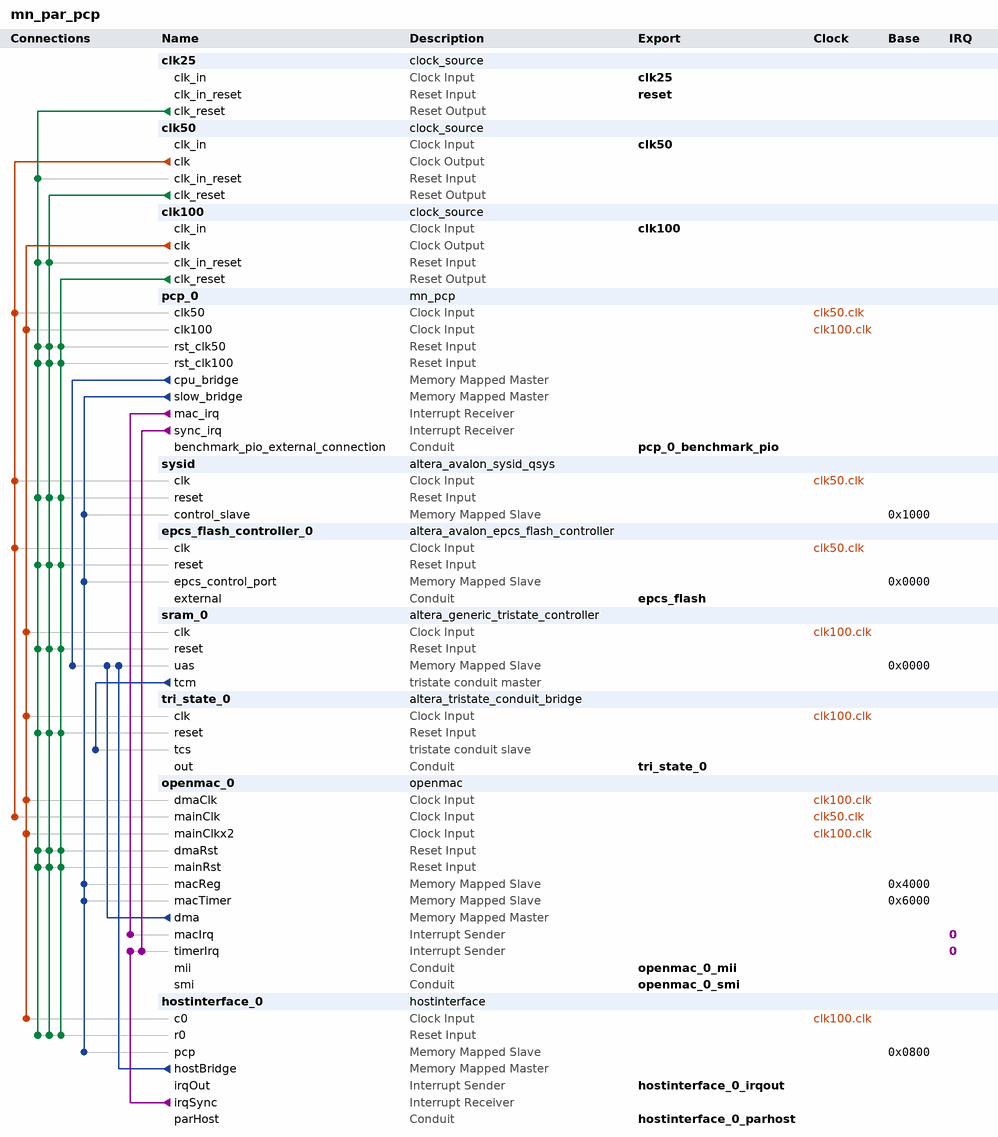
[diagram p0: system contents]
# Platform Designer (Qsys) system mn_par_pcp, Cyclone IV E EP4CE115F29C7
# Parameters at their usual value, and those the tool derives, are not listed.
package require -exact qsys 13.0
create_system mn_par_pcp
set_project_property DEVICE_FAMILY {Cyclone IV E}
set_project_property DEVICE EP4CE115F29C7

add_instance clk25 clock_source 13.0
set_instance_parameter_value clk25 clockFrequency 25000000

add_instance clk50 clock_source 13.0
set_instance_parameter_value clk50 clockFrequency 50000000

add_instance clk100 clock_source 13.0
set_instance_parameter_value clk100 clockFrequency 100000000

add_instance pcp_0 mn_pcp 1.0

add_instance sysid altera_avalon_sysid_qsys 13.0
set_instance_parameter_value sysid id 0

add_instance epcs_flash_controller_0 altera_avalon_epcs_flash_controller 13.0.1.99.2

add_instance sram_0 altera_generic_tristate_controller 13.0
set_instance_parameter_value sram_0 TCM_ADDRESS_W 21
set_instance_parameter_value sram_0 TCM_DATA_W 16
set_instance_parameter_value sram_0 TCM_BYTEENABLE_W 2
set_instance_parameter_value sram_0 TCM_READ_WAIT 1
set_instance_parameter_value sram_0 TCM_WRITE_WAIT 0
set_instance_parameter_value sram_0 TCM_SETUP_WAIT 0
set_instance_parameter_value sram_0 TCM_DATA_HOLD 0
set_instance_parameter_value sram_0 TCM_MAX_PENDING_READ_TRANSACTIONS 1
set_instance_parameter_value sram_0 TCM_TURNAROUND_TIME 1
set_instance_parameter_value sram_0 TCM_TIMING_UNITS 1
set_instance_parameter_value sram_0 TCM_READLATENCY 2
set_instance_parameter_value sram_0 TCM_SYMBOLS_PER_WORD 2
set_instance_parameter_value sram_0 USE_READ 1
set_instance_parameter_value sram_0 USE_BEGINTRANSFER 0
set_instance_parameter_value sram_0 USE_BYTEENABLE 1
set_instance_parameter_value sram_0 USE_OUTPUTENABLE 0
set_instance_parameter_value sram_0 ACTIVE_LOW_READ 1
set_instance_parameter_value sram_0 ACTIVE_LOW_BYTEENABLE 1
set_instance_parameter_value sram_0 ACTIVE_LOW_OUTPUTENABLE 0
set_instance_parameter_value sram_0 ACTIVE_LOW_BEGINTRANSFER 0
set_instance_parameter_value sram_0 CHIPSELECT_THROUGH_READLATENCY 0
set_instance_parameter_value sram_0 MODULE_ASSIGNMENT_KEYS embeddedsw.CMacro.SIZE
set_instance_parameter_value sram_0 MODULE_ASSIGNMENT_VALUES 2097152

add_instance tri_state_0 altera_tristate_conduit_bridge 13.0

add_instance openmac_0 openmac 1.0.0
set_instance_parameter_value openmac_0 gui_phyType 2
set_instance_parameter_value openmac_0 gui_phyCount 2
set_instance_parameter_value openmac_0 gui_extraSmi true
set_instance_parameter_value openmac_0 gui_txBufLoc 2
set_instance_parameter_value openmac_0 gui_txBufSize 1
set_instance_parameter_value openmac_0 gui_txBurstSize 8
set_instance_parameter_value openmac_0 gui_rxBurstSize 1
set_instance_parameter_value openmac_0 gui_tmrCount 1
set_instance_parameter_value openmac_0 gui_actEn false

add_instance hostinterface_0 hostinterface 0.0.4
set_instance_parameter_value hostinterface_0 sys_uniqueId 0
set_instance_parameter_value hostinterface_0 gui_interfaceTyp 1
set_instance_parameter_value hostinterface_0 gui_parallelMltplx 1
set_instance_parameter_value hostinterface_0 gui_parallelDwidth 16
set_instance_parameter_value hostinterface_0 gui_sizeDynBuf0 2
set_instance_parameter_value hostinterface_0 gui_sizeDynBuf1 2
set_instance_parameter_value hostinterface_0 gui_sizeErrorCnter 3108
set_instance_parameter_value hostinterface_0 gui_sizeTxNmtQ 2
set_instance_parameter_value hostinterface_0 gui_sizeTxGenQ 2
set_instance_parameter_value hostinterface_0 gui_sizeTxSyncQ 2
set_instance_parameter_value hostinterface_0 gui_sizeTxVethQ 2
set_instance_parameter_value hostinterface_0 gui_sizeRxVethQ 1
set_instance_parameter_value hostinterface_0 gui_sizeK2UQ 8
set_instance_parameter_value hostinterface_0 gui_sizeU2KQ 8
set_instance_parameter_value hostinterface_0 gui_sizeTpdo 1024
set_instance_parameter_value hostinterface_0 gui_sizeRpdo 10240

# connections
add_connection clk50.clk epcs_flash_controller_0.clk clock
add_connection clk50.clk openmac_0.mainClk clock
add_connection clk50.clk pcp_0.clk50 clock
add_connection clk50.clk sysid.clk clock
add_connection clk100.clk hostinterface_0.c0 clock
add_connection clk100.clk openmac_0.dmaClk clock
add_connection clk100.clk openmac_0.mainClkx2 clock
add_connection clk100.clk pcp_0.clk100 clock
add_connection clk100.clk sram_0.clk clock
add_connection clk100.clk tri_state_0.clk clock
add_connection clk25.clk_reset clk50.clk_in_reset reset
add_connection clk25.clk_reset clk100.clk_in_reset reset
add_connection clk25.clk_reset epcs_flash_controller_0.reset reset
add_connection clk25.clk_reset hostinterface_0.r0 reset
add_connection clk25.clk_reset openmac_0.dmaRst reset
add_connection clk25.clk_reset openmac_0.mainRst reset
add_connection clk25.clk_reset pcp_0.rst_clk50 reset
add_connection clk25.clk_reset pcp_0.rst_clk100 reset
add_connection clk25.clk_reset sram_0.reset reset
add_connection clk25.clk_reset sysid.reset reset
add_connection clk25.clk_reset tri_state_0.reset reset
add_connection clk50.clk_reset clk100.clk_in_reset reset
add_connection clk50.clk_reset epcs_flash_controller_0.reset reset
add_connection clk50.clk_reset hostinterface_0.r0 reset
add_connection clk50.clk_reset openmac_0.dmaRst reset
add_connection clk50.clk_reset openmac_0.mainRst reset
add_connection clk50.clk_reset pcp_0.rst_clk50 reset
add_connection clk50.clk_reset pcp_0.rst_clk100 reset
add_connection clk50.clk_reset sram_0.reset reset
add_connection clk50.clk_reset sysid.reset reset
add_connection clk50.clk_reset tri_state_0.reset reset
add_connection clk100.clk_reset epcs_flash_controller_0.reset reset
add_connection clk100.clk_reset hostinterface_0.r0 reset
add_connection clk100.clk_reset openmac_0.dmaRst reset
add_connection clk100.clk_reset openmac_0.mainRst reset
add_connection clk100.clk_reset pcp_0.rst_clk50 reset
add_connection clk100.clk_reset pcp_0.rst_clk100 reset
add_connection clk100.clk_reset sram_0.reset reset
add_connection clk100.clk_reset sysid.reset reset
add_connection clk100.clk_reset tri_state_0.reset reset
add_connection hostinterface_0.hostBridge sram_0.uas avalon
set_connection_parameter_value hostinterface_0.hostBridge/sram_0.uas baseAddress 0x0000
add_connection openmac_0.dma sram_0.uas avalon
set_connection_parameter_value openmac_0.dma/sram_0.uas baseAddress 0x0000
add_connection pcp_0.cpu_bridge sram_0.uas avalon
set_connection_parameter_value pcp_0.cpu_bridge/sram_0.uas baseAddress 0x0000
add_connection pcp_0.slow_bridge epcs_flash_controller_0.epcs_control_port avalon
set_connection_parameter_value pcp_0.slow_bridge/epcs_flash_controller_0.epcs_control_port baseAddress 0x0000
add_connection pcp_0.slow_bridge hostinterface_0.pcp avalon
set_connection_parameter_value pcp_0.slow_bridge/hostinterface_0.pcp baseAddress 0x0800
add_connection pcp_0.slow_bridge openmac_0.macReg avalon
set_connection_parameter_value pcp_0.slow_bridge/openmac_0.macReg baseAddress 0x4000
add_connection pcp_0.slow_bridge openmac_0.macTimer avalon
set_connection_parameter_value pcp_0.slow_bridge/openmac_0.macTimer baseAddress 0x6000
add_connection pcp_0.slow_bridge sysid.control_slave avalon
set_connection_parameter_value pcp_0.slow_bridge/sysid.control_slave baseAddress 0x1000
add_connection hostinterface_0.irqSync openmac_0.timerIrq interrupt
set_connection_parameter_value hostinterface_0.irqSync/openmac_0.timerIrq irqNumber 0
add_connection pcp_0.mac_irq openmac_0.macIrq interrupt
set_connection_parameter_value pcp_0.mac_irq/openmac_0.macIrq irqNumber 0
add_connection pcp_0.sync_irq openmac_0.timerIrq interrupt
set_connection_parameter_value pcp_0.sync_irq/openmac_0.timerIrq irqNumber 0
add_connection sram_0.tcm tri_state_0.tcs tristate_conduit

# exported interfaces
add_interface clk50 clock sink
set_interface_property clk50 EXPORT_OF clk50.clk_in
add_interface clk100 clock sink
set_interface_property clk100 EXPORT_OF clk100.clk_in
add_interface clk25 clock sink
set_interface_property clk25 EXPORT_OF clk25.clk_in
add_interface reset reset sink
set_interface_property reset EXPORT_OF clk25.clk_in_reset
add_interface pcp_0_benchmark_pio conduit end
set_interface_property pcp_0_benchmark_pio EXPORT_OF pcp_0.benchmark_pio_external_connection
add_interface epcs_flash conduit end
set_interface_property epcs_flash EXPORT_OF epcs_flash_controller_0.external
add_interface tri_state_0 conduit end
set_interface_property tri_state_0 EXPORT_OF tri_state_0.out
add_interface hostinterface_0_irqout interrupt sender
set_interface_property hostinterface_0_irqout EXPORT_OF hostinterface_0.irqOut
add_interface hostinterface_0_parhost conduit end
set_interface_property hostinterface_0_parhost EXPORT_OF hostinterface_0.parHost
add_interface openmac_0_mii conduit end
set_interface_property openmac_0_mii EXPORT_OF openmac_0.mii
add_interface openmac_0_smi conduit end
set_interface_property openmac_0_smi EXPORT_OF openmac_0.smi

set_interconnect_requirement {$system} qsys_mm.clockCrossingAdapter HANDSHAKE
set_interconnect_requirement {$system} qsys_mm.maxAdditionalLatency 1

save_system mn_par_pcp.qsys
